# EAGLE design adaptador2 (EAGLE 7.6.0)
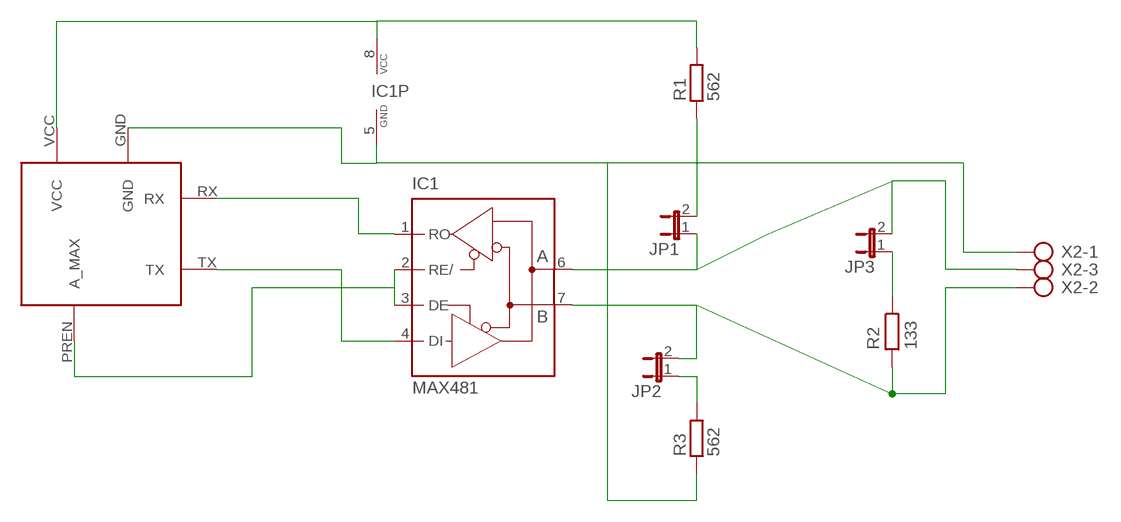
[diagram p0: schematic, sheet 1]

## Parts
1  MOD_ADAPTADOR  [ADAPTADOR]
IC1  MAX481  MAX481CPA  [DIL08]
JP1  JP1E  [JP1]
JP2  JP1E  [JP1]
JP3  JP1E  [JP1]
R1  562  R-EU_0207/10  [0207/10]
R2  133  R-EU_0207/10  [0207/10]
R3  562  R-EU_0207/10  [0207/10]
X2  AK300/3  [AK300/3]

## Nets
+5V_EXT: 1.VCC IC1.8(VCC) R1.2
GND_EXT: 1.GND IC1.5(GND) R3.1 X2.1
N$1: JP1.2 R1.1
N$2: JP2.1 R3.2
N$3: JP3.1 R2.1
N$4: 1.RX IC1.1(RO)
N$6: 1.PREN(A_MAX) IC1.2(RE/) IC1.3(DE)
N$7: 1.TX IC1.4(DI)
N$15: IC1.7(B) JP2.2 R2.2 X2.2
N$17: IC1.6(A) JP1.1 JP3.2 X2.3

## Library data of the parts
1 = AAdaptador:MOD_ADAPTADOR; ATRIBUTO: valor
IC1 = mathertel:MAX481CPA: RS485 TRANSEIVER; MPN: MAX481CPA+; OC_FARNELL: unknown; OC_NEWARK: 99K3445
JP1-JP3 = jumper:JP1E: JUMPER
R1-R3 = resistor:R-EU_: RESISTOR, European symbol
X2 = con-ptr500:AK300/3: CONNECTOR; OC_FARNELL: unknown; OC_NEWARK: unknown

## Net classes
0 default: width 1.016 mm, drill 1.016 mm
1 power: width 0.508 mm

## Board
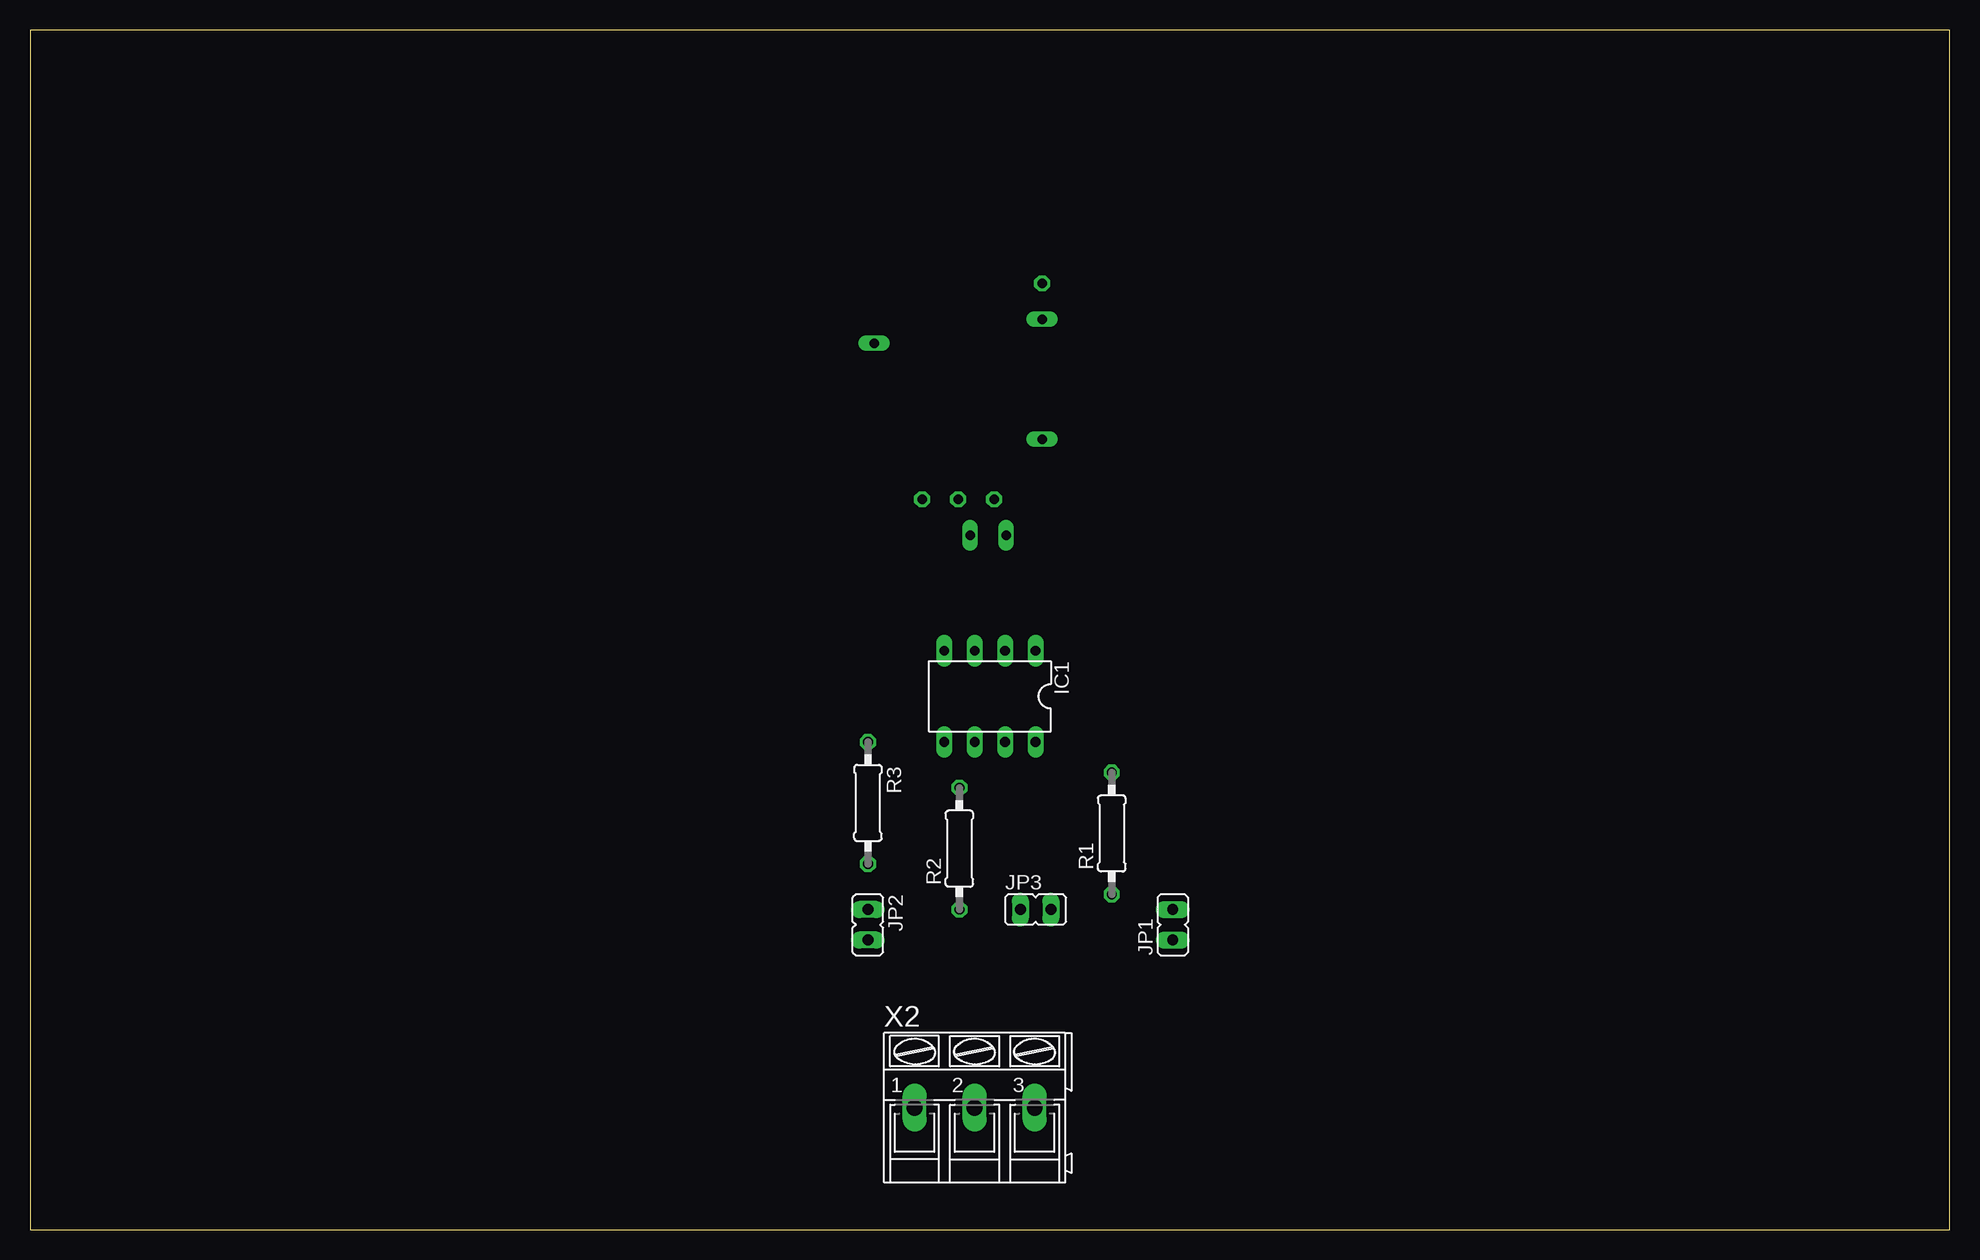
[diagram p1: board, top side]
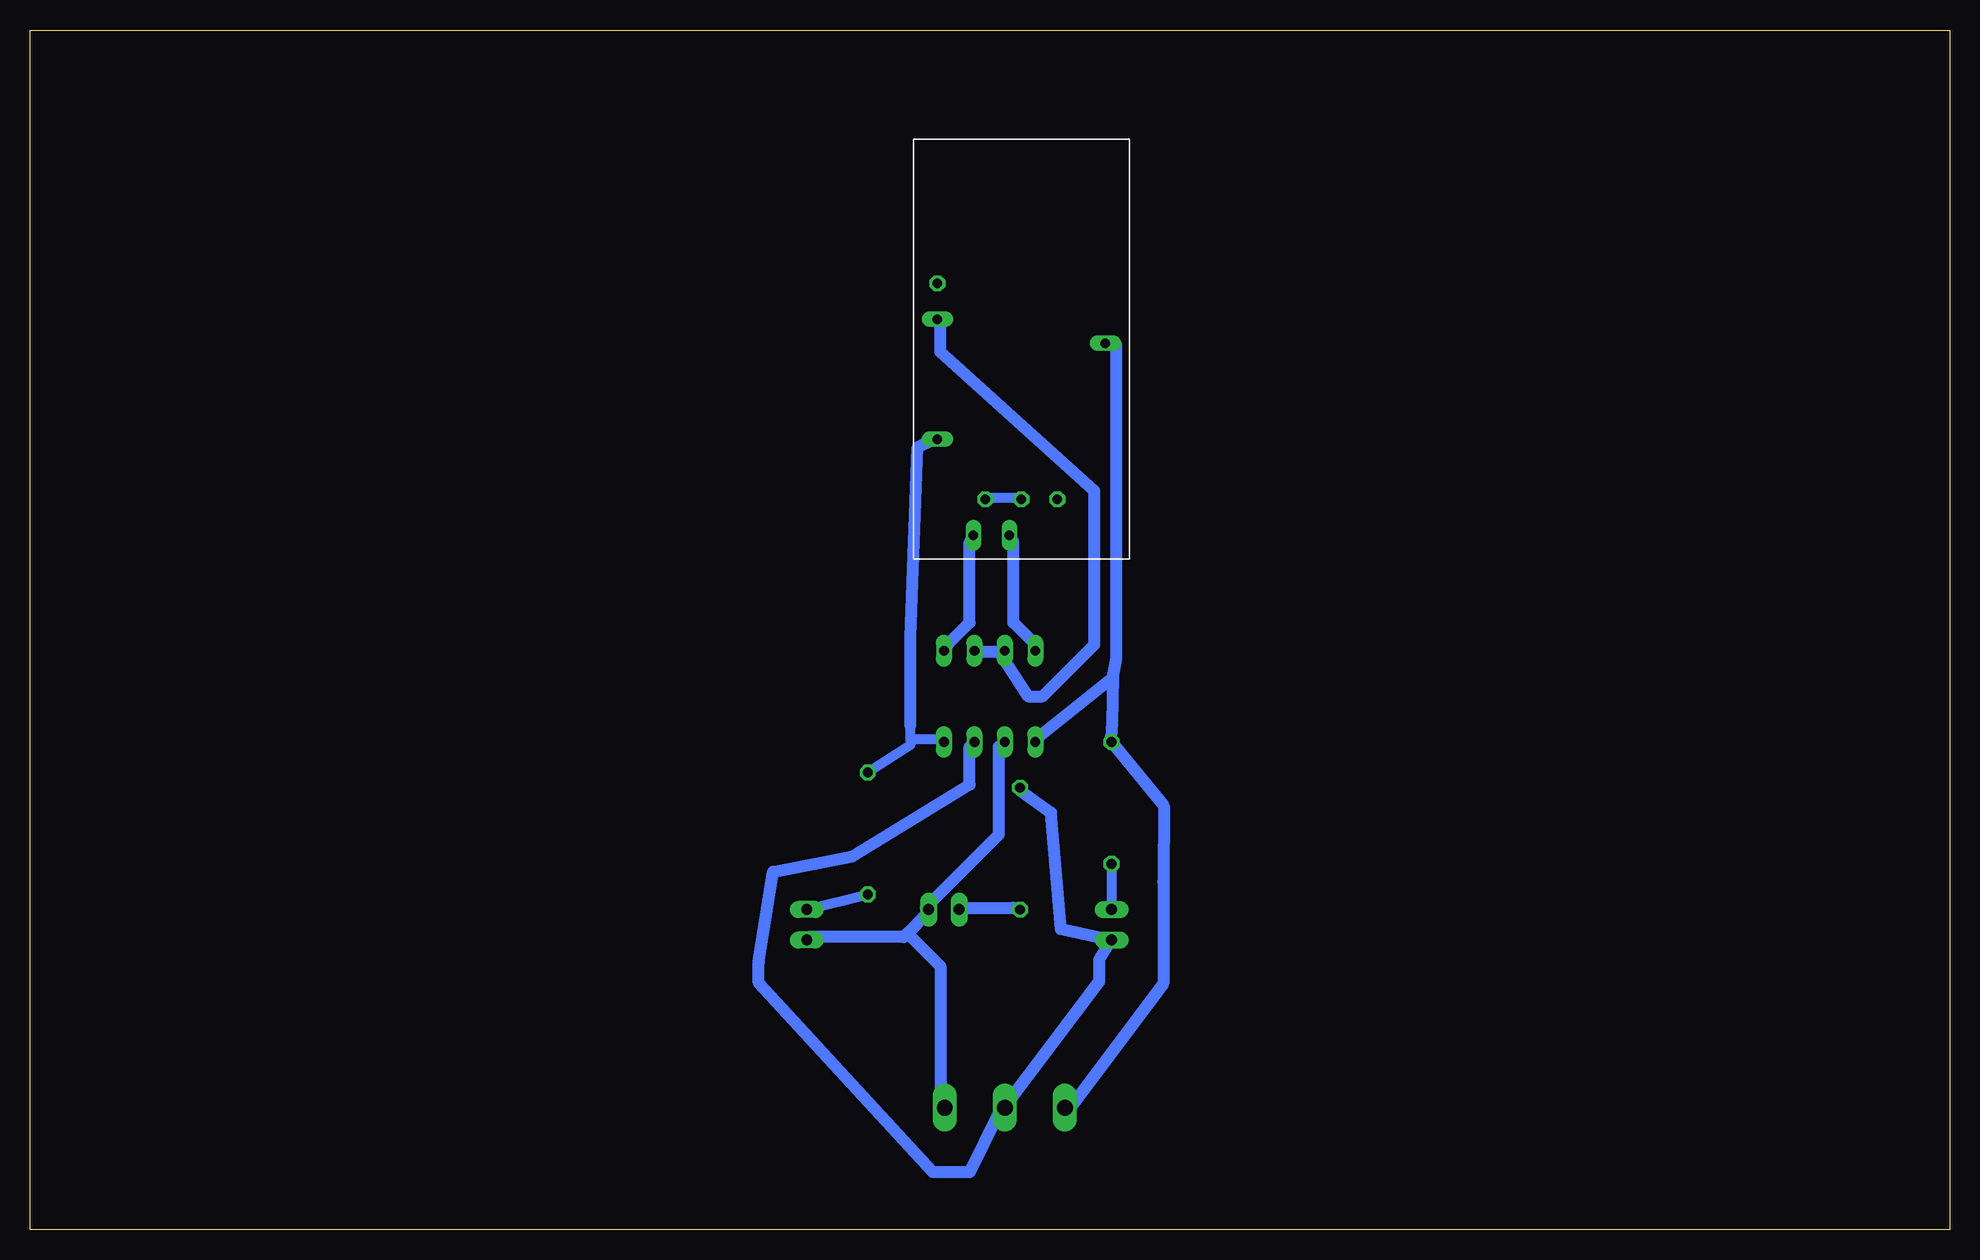
[diagram p2: board, bottom side, seen from below]

Size 160 x 100 mm. Coordinates in mm from the lower left corner, seen from the top.
Outline: 0,0 160,0 160,100 0,100 0,0
Copper layers (1*16): Top 0.035mm / dielectric 1.5mm / Bottom 0.035mm
Design rules "default": minimum track width 10mil, minimum drill 24mil, track to track 8mil, track to pad 8mil, pad to pad 8mil, via to via 8mil, smd to smd 8mil, copper to edge 40mil, drill to drill 8mil, minimum pad ring 10mil, minimum via ring 8mil, stop-mask expansion 4mil, vias tented up to drill 0mil, thermal gap 10mil

### Footprints (pad centres in the part's own frame; a part is rotated, then mirrored left to right if it is on the bottom)
ADAPTADOR = drill 0.8 long: GND 16,18; PREN 2,20; RX 5,2; TX 8,2; VCC 2,10 | drill 0.8 octagon: P$1 6,5; P$2 9,5; P$3 12,5; P$4 2,23
DIL08 = drill 0.813 long: 1 -3.81,-3.81; 2 -1.27,-3.81; 3 1.27,-3.81; 4 3.81,-3.81; 5 3.81,3.81; 6 1.27,3.81; 7 -1.27,3.81; 8 -3.81,3.81
JP1 = drill 0.914 long: 1 0,-1.27; 2 0,1.27
0207/10 = drill 0.813 octagon: 1 -5.08,0; 2 5.08,0
AK300/3 = drill 1.321 long: 1 -5.004,0; 2 0,0; 3 5.004,0

### Placement (x,y rotation side)
1  86.36,55.88 0 bottom
IC1  80.01,44.45 180 top
JP1  95.25,25.4 0 top
JP2  69.85,25.4 180 top
JP3  83.82,26.67 270 top
R1  90.17,33.02 90 top
R2  77.47,31.75 90 top
R3  69.85,35.56 270 top
X2  78.74,10.16 0 top

### Tracks (layer width: path | path; a pad name or v marks a point on that pad's centre or on a via)
+5V_EXT
  Bottom 0.813: 84.12,40.84 86.61,40.84 | 86.61,40.84 86.61,42.06 | 86.61,40.84 86.61,40.39 R1.2
  Bottom 1.016: 86.61,42.06 86.61,49.38 86,65.23 84.73,65.84 1.VCC | 84.12,40.84 IC1.8
GND_EXT
  Bottom 1.016: 69.75,46.02 76.2,40.84 IC1.5 | 69.75,46.02 69.44,47.6 69.44,73.76 1.GND | 69.75,46.02 69.8,42.27 69.9,41 R3.1 65.48,35.31 65.53,29.01 65.53,20.52 73.15,10.36 X2.1
N$1
  Bottom 0.813: JP1.2 R1.1
N$2
  Bottom 0.813: R3.2 JP2.1
N$3
  Bottom 1.016: R2.1 78.03,26.82 82.3,26.82 JP3.1
N$4
  Bottom 1.016: 1.RX 81.69,57.3 81.69,50.6 83.52,48.77 IC1.1
N$5
  Bottom 0.813: 77.47,60.96 80.01,60.96
N$6
  Bottom 1.016: 79.25,48.16 76.81,44.45 75.59,44.45 71.27,48.77 71.27,61.57 84.12,73.15 84.12,75.59 1.PREN | 79.25,48.16 81.08,48.16 IC1.2 | 79.25,48.16 IC1.3
N$7
  Bottom 1.016: 1.TX 78.03,57.3 78.03,50.6 76.2,48.77 IC1.4
N$15
  Bottom 1.016: R2.2 77.42,36.58 74.88,34.75 74.07,25.04 JP2.2 70.87,22.5 70.87,20.68 78.64,10.36 X2.2 79.25,9.75 81.69,4.78 84.73,4.78 99.26,20.57 99.26,22.25 98.04,29.82 91.49,31.09 81.69,37.08 81.69,40.23 IC1.7
N$17
  Bottom 1.016: IC1.6 79.25,40.23 79.25,32.92 85.34,26.82 JP3.2 85.34,26.21 86.87,24.69 | 86.87,24.69 87.17,24.38 95.1,24.38 JP1.1 | 86.87,24.69 84.12,21.95 84.12,10.36 X2.3